# EAGLE schematic backplane_v3 (EAGLE 7.6.0)
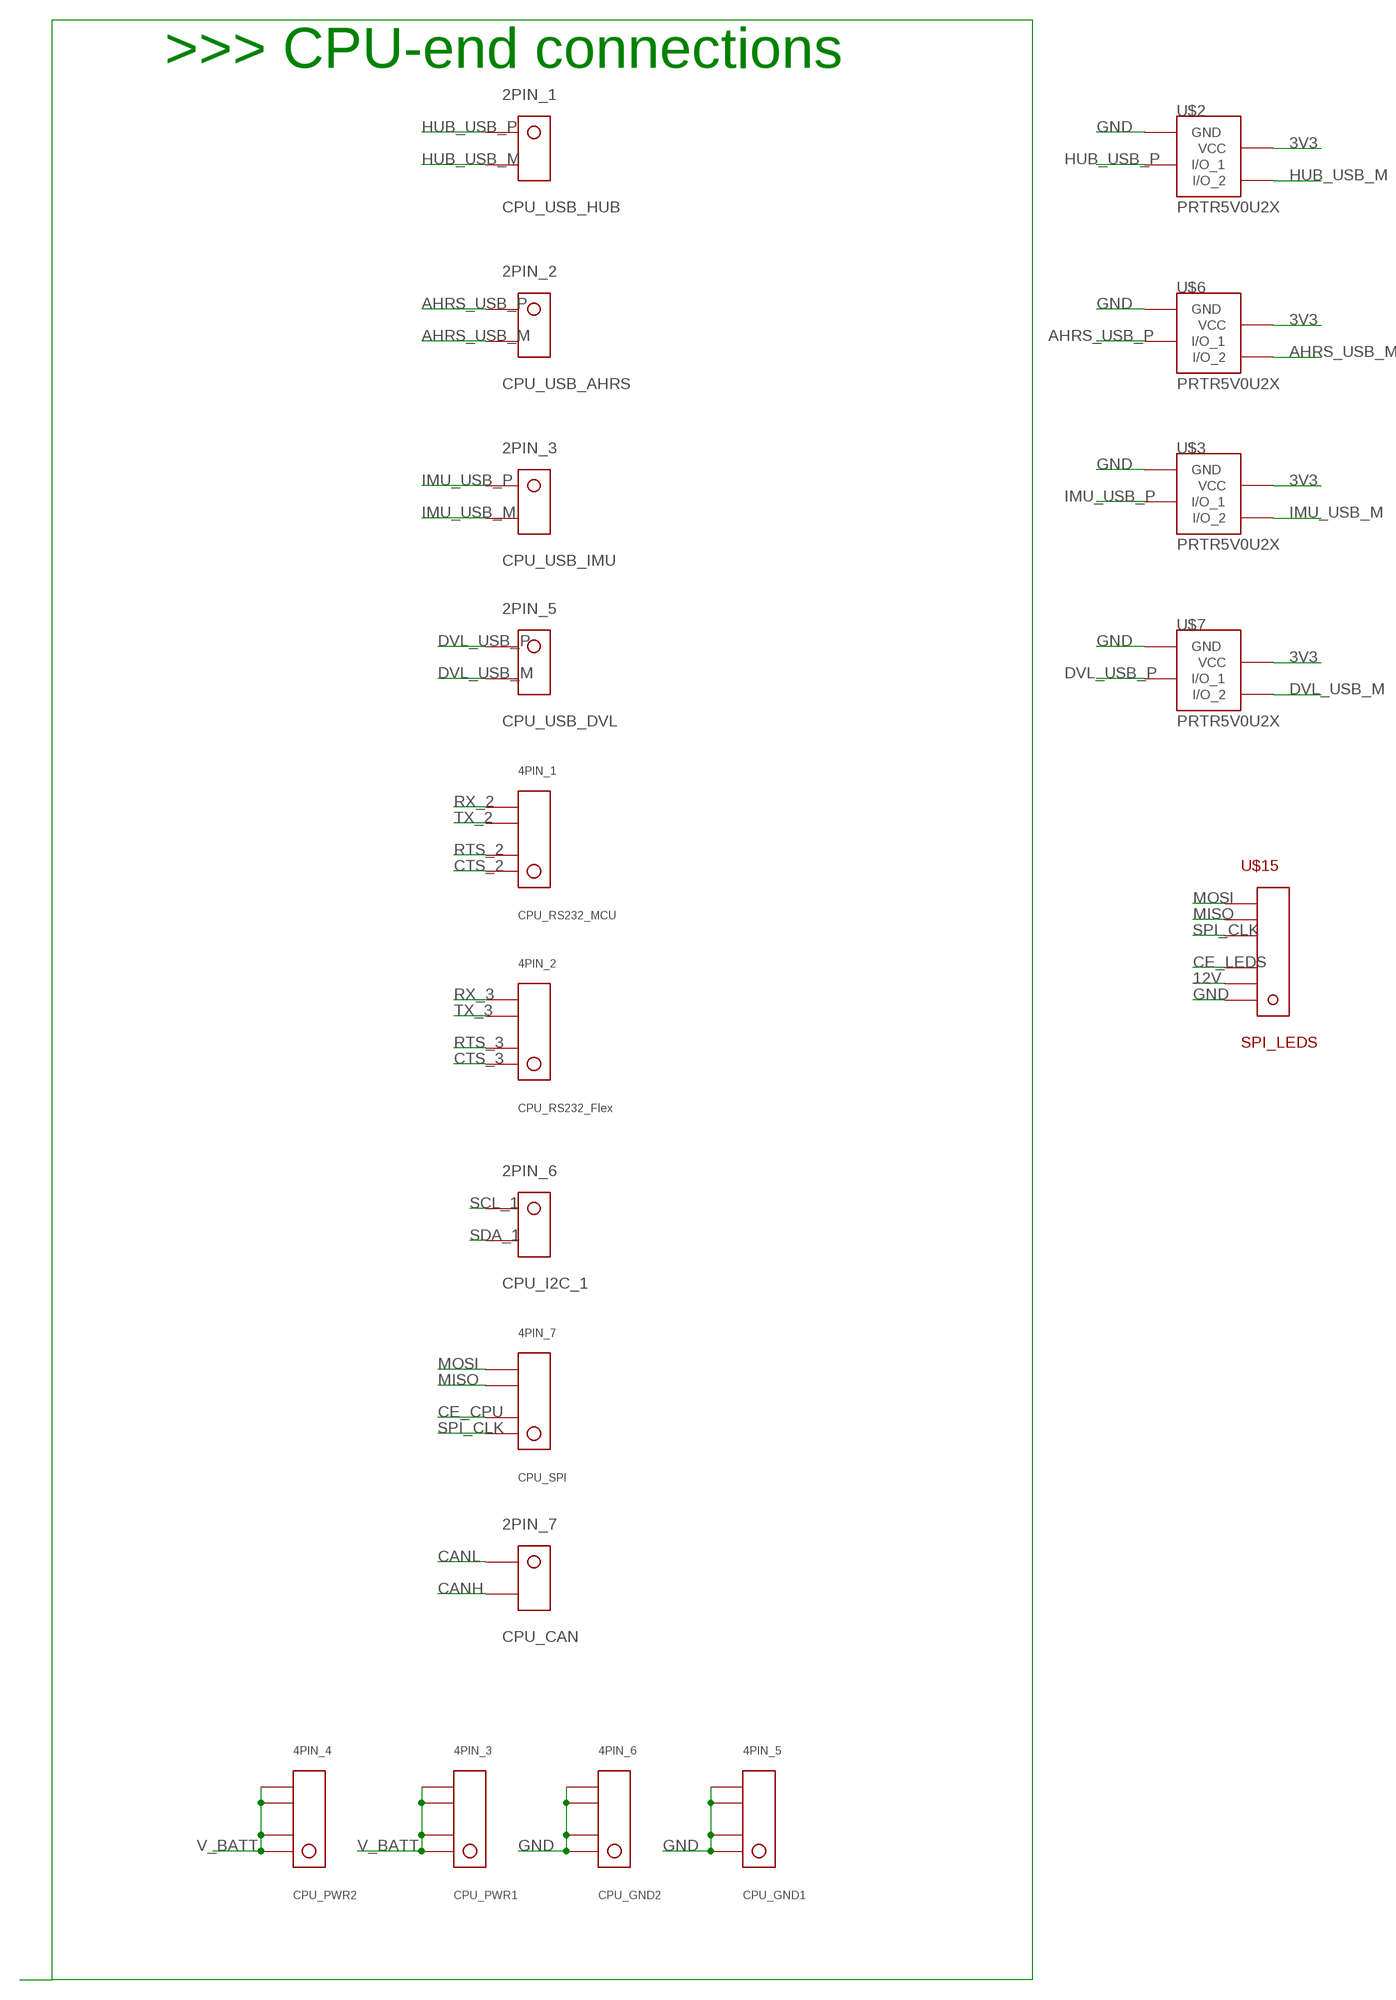
[diagram p0: schematic, sheet 1, part 1 of 3]
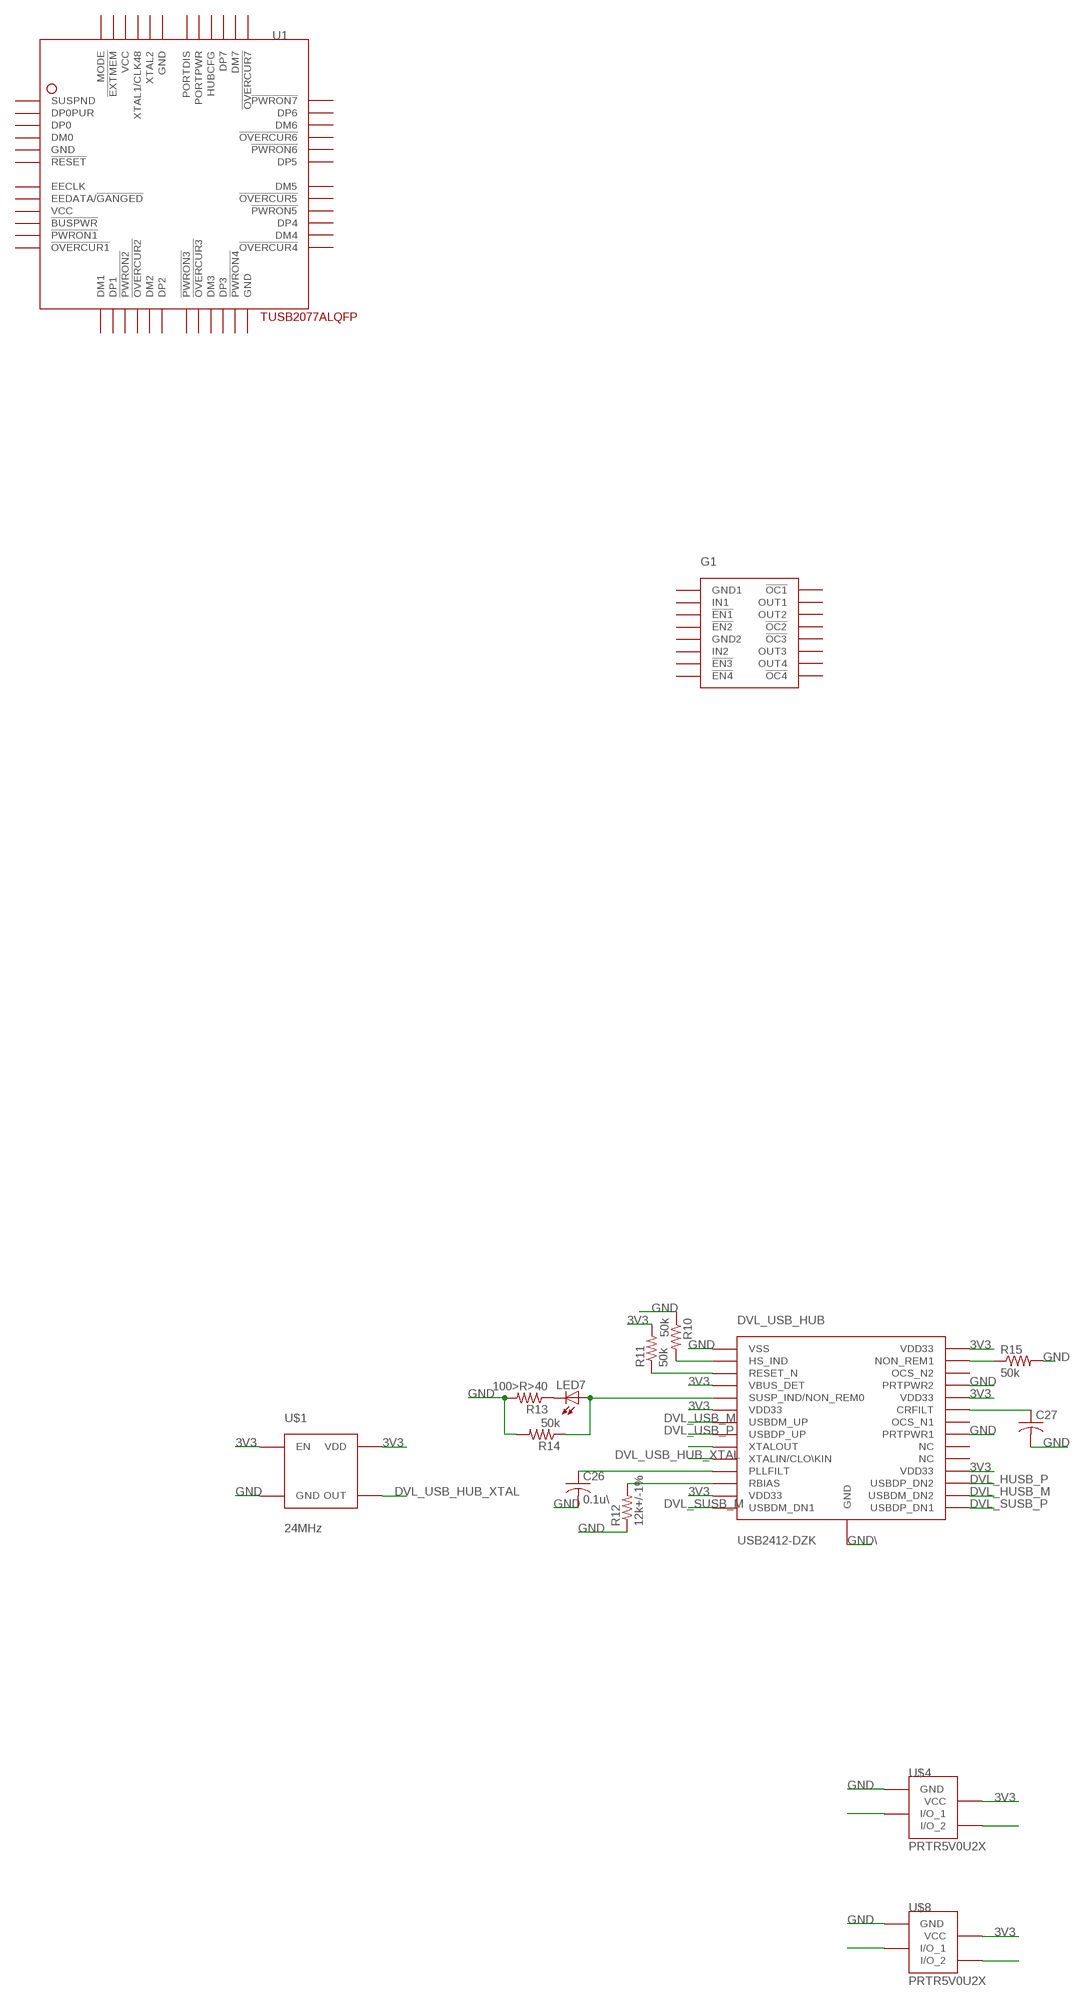
[diagram p1: schematic, sheet 1, part 2 of 3]
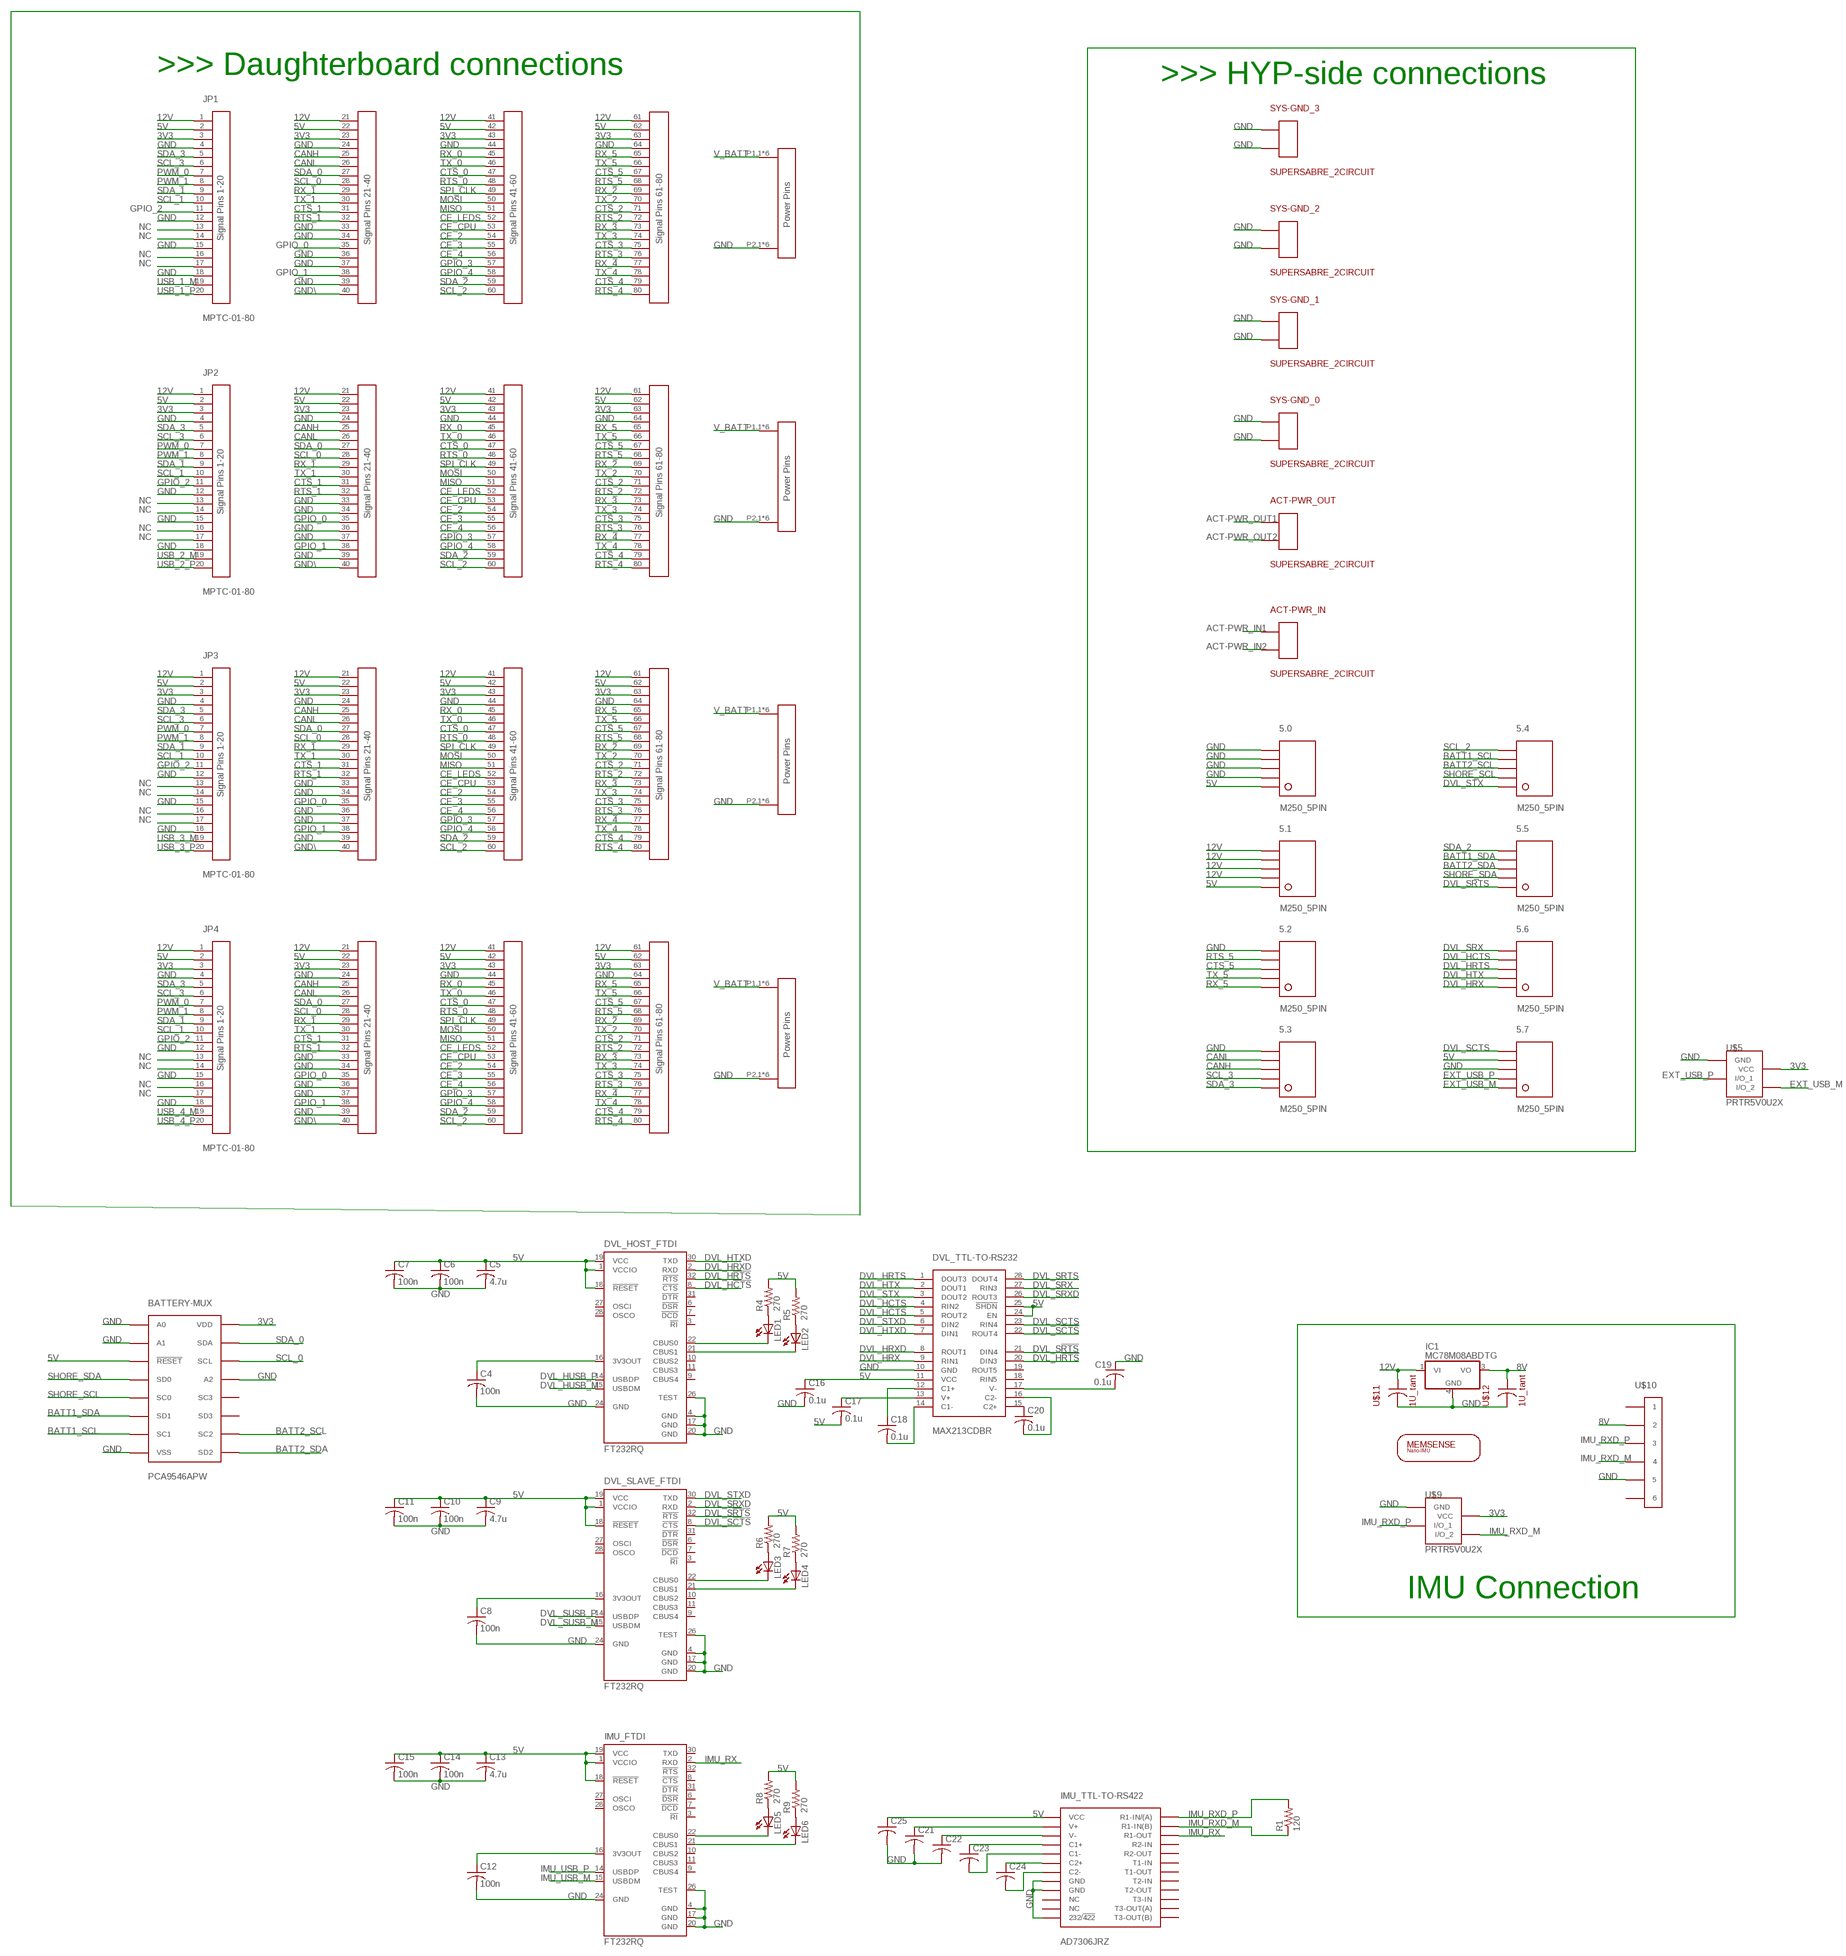
[diagram p2: schematic, sheet 1, part 3 of 3]

## Parts
2PIN_1  CPU_USB_HUB  KK254_VERT_2PIN22-29-2021  [KK254_VERT_2PIN]
2PIN_2  CPU_USB_AHRS  KK254_VERT_2PIN22-29-2021  [KK254_VERT_2PIN]
2PIN_3  CPU_USB_IMU  KK254_VERT_2PIN22-29-2021  [KK254_VERT_2PIN]
2PIN_5  CPU_USB_DVL  KK254_VERT_2PIN22-29-2021  [KK254_VERT_2PIN]
2PIN_6  CPU_I2C_1  KK254_VERT_2PIN22-29-2021  [KK254_VERT_2PIN]
2PIN_7  CPU_CAN  KK254_VERT_2PIN22-29-2021  [KK254_VERT_2PIN]
4PIN_1  CPU_RS232_MCU  KK254_VERT_4PIN22-29-2041  [KK254_VERT_4PIN]
4PIN_2  CPU_RS232_Flex  KK254_VERT_4PIN22-29-2041  [KK254_VERT_4PIN]
4PIN_3  CPU_PWR1  KK254_VERT_4PIN22-29-2041  [KK254_VERT_4PIN]
4PIN_4  CPU_PWR2  KK254_VERT_4PIN22-29-2041  [KK254_VERT_4PIN]
4PIN_5  CPU_GND1  KK254_VERT_4PIN22-29-2041  [KK254_VERT_4PIN]
4PIN_6  CPU_GND2  KK254_VERT_4PIN22-29-2041  [KK254_VERT_4PIN]
4PIN_7  CPU_SPI  KK254_VERT_4PIN22-29-2041  [KK254_VERT_4PIN]
5.0  M250_5PIN  [M205_5PIN]
5.1  M250_5PIN  [M205_5PIN]
5.2  M250_5PIN  [M205_5PIN]
5.3  M250_5PIN  [M205_5PIN]
5.4  M250_5PIN  [M205_5PIN]
5.5  M250_5PIN  [M205_5PIN]
5.6  M250_5PIN  [M205_5PIN]
5.7  M250_5PIN  [M205_5PIN]
ACT-PWR_IN  SUPERSABRE_2CIRCUIT  [SUPERSABRE_2CIRCUIT]
ACT-PWR_OUT  SUPERSABRE_2CIRCUIT  [SUPERSABRE_2CIRCUIT]
BATTERY-MUX  PCA9546APW  [TSSOP16]
C4  100n  C-USC0805  [C0805]
C5  4.7u  C-USC0805  [C0805]
C6  100n  C-USC0805  [C0805]
C7  100n  C-USC0805  [C0805]
C8  100n  C-USC0805  [C0805]
C9  4.7u  C-USC0805  [C0805]
C10  100n  C-USC0805  [C0805]
C11  100n  C-USC0805  [C0805]
C12  100n  C-USC0805  [C0805]
C13  4.7u  C-USC0805  [C0805]
C14  100n  C-USC0805  [C0805]
C15  100n  C-USC0805  [C0805]
C16  0.1u  C-USC0805  [C0805]
C17  0.1u  C-USC0805  [C0805]
C18  0.1u  C-USC0805  [C0805]
C19  0.1u  C-USC0805  [C0805]
C20  0.1u  C-USC0805  [C0805]
C21  C-USC0805  [C0805]
C22  C-USC0805  [C0805]
C23  C-USC0805  [C0805]
C24  C-USC0805  [C0805]
C25  C-USC0805  [C0805]
C26  0.1u\  C-USC0805  [C0805]
C27  C-USC0805  [C0805]
DVL_HOST_FTDI  FT232RQ  [QFN32]
DVL_SLAVE_FTDI  FT232RQ  [QFN32]
DVL_TTL-TO-RS232  MAX213CDBR  [SSOP28DB]
DVL_USB_HUB  USB2412-DZK  [QFN-28]
G1  TPS2044BBD-SOIC  [TPS2044]
IC1  MC78M08ABDTG  [DPACK_3]
IMU_FTDI  FT232RQ  [QFN32]
IMU_TTL-TO-RS422  AD7306JRZ  [SOIC-24]
JP1  MPTC-01-80  [MPTC-01-80]
JP2  MPTC-01-80  [MPTC-01-80]
JP3  MPTC-01-80  [MPTC-01-80]
JP4  MPTC-01-80  [MPTC-01-80]
LED1  LEDCHIPLED_0805  [CHIPLED_0805]
LED2  LEDCHIPLED_0805  [CHIPLED_0805]
LED3  LEDCHIPLED_0805  [CHIPLED_0805]
LED4  LEDCHIPLED_0805  [CHIPLED_0805]
LED5  LEDCHIPLED_0805  [CHIPLED_0805]
LED6  LEDCHIPLED_0805  [CHIPLED_0805]
LED7  LEDCHIPLED_0805  [CHIPLED_0805]
R1  120  R-US_R0805  [R0805]
R4  270  R-US_R0805  [R0805]
R5  270  R-US_R0805  [R0805]
R6  270  R-US_R0805  [R0805]
R7  270  R-US_R0805  [R0805]
R8  270  R-US_R0805  [R0805]
R9  270  R-US_R0805  [R0805]
R10  50k  R-US_R0805  [R0805]
R11  50k  R-US_R0805  [R0805]
R12  12k+/-1%  R-US_R0805  [R0805]
R13  100>R>40  R-US_R0805  [R0805]
R14  50k  R-US_R0805  [R0805]
R15  50k  R-US_R0805  [R0805]
SYS-GND_0  SUPERSABRE_2CIRCUIT  [SUPERSABRE_2CIRCUIT]
SYS-GND_1  SUPERSABRE_2CIRCUIT  [SUPERSABRE_2CIRCUIT]
SYS-GND_2  SUPERSABRE_2CIRCUIT  [SUPERSABRE_2CIRCUIT]
SYS-GND_3  SUPERSABRE_2CIRCUIT  [SUPERSABRE_2CIRCUIT]
U1  TUSB2077ALQFP  [48-LQFP_0.5MM_PITCH]
U$1  24MHz  DCS6XXX  [4-CDFN_3.2X2.5MM]
U$2  PRTR5V0U2X  [SOT143B]
U$3  PRTR5V0U2X  [SOT143B]
U$4  PRTR5V0U2X  [SOT143B]
U$5  PRTR5V0U2X  [SOT143B]
U$6  PRTR5V0U2X  [SOT143B]
U$7  PRTR5V0U2X  [SOT143B]
U$8  PRTR5V0U2X  [SOT143B]
U$9  PRTR5V0U2X  [SOT143B]
U$10  HR30-6R-6PD  [HR30-6R-6PD]
U$11  1U_tant  F93-XX-XXX-X-A  [F93-XX-XXX-X-A]
U$12  1U_tant  F93-XX-XXX-X-A  [F93-XX-XXX-X-A]
U$13  MEMSENSE_NIMU  [MEMSENSE_NIMU]
U$15  SPI_LEDS  KK254_6PIN  [KK254_6PIN]

## Nets
3V3: BATTERY-MUX.P$16(VDD) DVL_USB_HUB.P$4(VDD33) DVL_USB_HUB.P$10(VDD33) DVL_USB_HUB.P$14(VDD33) DVL_USB_HUB.P$18(VBUS_DET) DVL_USB_HUB.P$20(VDD33) DVL_USB_HUB.P$27(VDD33) JP1.3 JP1.23 JP1.43 JP1.63 JP2.3 JP2.23 JP2.43 JP2.63 JP3.3 JP3.23 JP3.43 JP3.63 JP4.3 JP4.23 JP4.43 JP4.63 R11.2 U$1.P$1(EN) U$1.P$4(VDD) U$2.P$4(VCC) U$3.P$4(VCC) U$4.P$4(VCC) U$5.P$4(VCC) U$6.P$4(VCC) U$7.P$4(VCC) U$8.P$4(VCC) U$9.P$4(VCC)
5V: 5.0.P$1 5.0.P$2 5.1.P$1 5.1.P$2 5.7.P$7 5.7.P$8 BATTERY-MUX.P$3(!RESET!) C5.1 C6.1 C7.1 C9.1 C10.1 C11.1 C13.1 C14.1 C15.1 C16.1 C17.2 C25.1 DVL_HOST_FTDI.1(VCCIO) DVL_HOST_FTDI.18(!RESET) DVL_HOST_FTDI.19(VCC) DVL_SLAVE_FTDI.1(VCCIO) DVL_SLAVE_FTDI.18(!RESET) DVL_SLAVE_FTDI.19(VCC) DVL_TTL-TO-RS232.11(VCC) DVL_TTL-TO-RS232.24(EN) DVL_TTL-TO-RS232.25(!SHDN!) IMU_FTDI.1(VCCIO) IMU_FTDI.18(!RESET) IMU_FTDI.19(VCC) IMU_TTL-TO-RS422.P$7(VCC) JP1.2 JP1.22 JP1.42 JP1.62 JP2.2 JP2.22 JP2.42 JP2.62 JP3.2 JP3.22 JP3.42 JP3.62 JP4.2 JP4.22 JP4.42 JP4.62 R4.2 R5.2 R6.2 R7.2 R8.2 R9.2
8V: IC1.3(VO) U$10.P$2 U$12.P$1(+)
12V: 5.1.P$3 5.1.P$4 5.1.P$5 5.1.P$6 5.1.P$7 5.1.P$8 5.1.P$9 5.1.P$10 IC1.1(VI) JP1.1 JP1.21 JP1.41 JP1.61 JP2.1 JP2.21 JP2.41 JP2.61 JP3.1 JP3.21 JP3.41 JP3.61 JP4.1 JP4.21 JP4.41 JP4.61 U$11.P$1(+) U$15.P$2
ACT-PWR_IN1: ACT-PWR_IN.P$1
ACT-PWR_IN2: ACT-PWR_IN.P$2
ACT-PWR_OUT1: ACT-PWR_OUT.P$1
ACT-PWR_OUT2: ACT-PWR_OUT.P$2
AHRS_USB_M: 2PIN_2.P$2 U$6.P$3(I/O_2)
AHRS_USB_P: 2PIN_2.P$1 U$6.P$2(I/O_1)
BATT1_SCL: 5.4.P$7 5.4.P$8 BATTERY-MUX.P$7(SC1)
BATT1_SDA: 5.5.P$7 5.5.P$8 BATTERY-MUX.P$6(SD1)
BATT2_SCL: 5.4.P$5 5.4.P$6 BATTERY-MUX.P$10(SC2)
BATT2_SDA: 5.5.P$5 5.5.P$6 BATTERY-MUX.P$9(SD2)
CANH: 2PIN_7.P$2 5.3.P$5 5.3.P$6 JP1.25 JP2.25 JP3.25 JP4.25
CANL: 2PIN_7.P$1 5.3.P$7 5.3.P$8 JP1.26 JP2.26 JP3.26 JP4.26
CE_2: JP1.54 JP2.54 JP3.54 JP4.54
CE_3: JP1.55 JP2.55 JP3.55 JP4.55
CE_4: JP1.56 JP2.56 JP3.56 JP4.56
CE_CPU: 4PIN_7.P$2 JP1.53 JP2.53 JP3.53 JP4.53
CE_LEDS: JP1.52 JP2.52 JP3.52 JP4.52 U$15.P$3
CTS_0: JP1.47 JP2.47 JP3.47 JP4.47
CTS_1: JP1.31 JP2.31 JP3.31 JP4.31
CTS_2: 4PIN_1.P$1 JP1.71 JP2.71 JP3.71 JP4.71
CTS_3: 4PIN_2.P$1 JP1.75 JP2.75 JP3.75 JP4.75
CTS_4: JP1.79 JP2.79 JP3.79 JP4.79
CTS_5: 5.2.P$5 5.2.P$6 JP1.67 JP2.67 JP3.67 JP4.67
DVL_H!CTS!: DVL_HOST_FTDI.8(!CTS) DVL_TTL-TO-RS232.5(ROUT2)
DVL_H!RTS!: DVL_HOST_FTDI.32(!RTS) DVL_TTL-TO-RS232.20(DIN3)
DVL_HCTS: 5.6.P$7 5.6.P$8 DVL_TTL-TO-RS232.4(RIN2)
DVL_HRTS: 5.6.P$5 5.6.P$6 DVL_TTL-TO-RS232.1(DOUT3)
DVL_HRX: 5.6.P$1 5.6.P$2 DVL_TTL-TO-RS232.9(RIN1)
DVL_HRXD: DVL_HOST_FTDI.2(RXD) DVL_TTL-TO-RS232.8(ROUT1)
DVL_HTX: 5.6.P$3 5.6.P$4 DVL_TTL-TO-RS232.2(DOUT1)
DVL_HTXD: DVL_HOST_FTDI.30(TXD) DVL_TTL-TO-RS232.7(DIN1)
DVL_HUSB_M: DVL_HOST_FTDI.15(USBDM) DVL_USB_HUB.P$2(USBDM_DN2)
DVL_HUSB_P: DVL_HOST_FTDI.14(USBDP) DVL_USB_HUB.P$3(USBDP_DN2)
DVL_S!CTS!: DVL_SLAVE_FTDI.8(!CTS) DVL_TTL-TO-RS232.22(ROUT4)
DVL_S!RTS!: DVL_SLAVE_FTDI.32(!RTS) DVL_TTL-TO-RS232.21(DIN4)
DVL_SCTS: 5.7.P$9 5.7.P$10 DVL_TTL-TO-RS232.23(RIN4)
DVL_SRTS: 5.5.P$1 5.5.P$2 DVL_TTL-TO-RS232.28(DOUT4)
DVL_SRX: 5.6.P$9 5.6.P$10 DVL_TTL-TO-RS232.27(RIN3)
DVL_SRXD: DVL_SLAVE_FTDI.2(RXD) DVL_TTL-TO-RS232.26(ROUT3)
DVL_STX: 5.4.P$1 5.4.P$2 DVL_TTL-TO-RS232.3(DOUT2)
DVL_STXD: DVL_SLAVE_FTDI.30(TXD) DVL_TTL-TO-RS232.6(DIN2)
DVL_SUSB_M: DVL_SLAVE_FTDI.15(USBDM) DVL_USB_HUB.P$28(USBDM_DN1)
DVL_SUSB_P: DVL_SLAVE_FTDI.14(USBDP) DVL_USB_HUB.P$1(USBDP_DN1)
DVL_USB_HUB_XTAL: DVL_USB_HUB.P$24(XTALIN/CLO\KIN) U$1.P$3(OUT)
DVL_USB_M: 2PIN_5.P$2 DVL_USB_HUB.P$21(USBDM_UP) U$7.P$3(I/O_2)
DVL_USB_P: 2PIN_5.P$1 DVL_USB_HUB.P$22(USBDP_UP) U$7.P$2(I/O_1)
EXT_USB_M: 5.7.P$1 5.7.P$2 U$5.P$3(I/O_2)
EXT_USB_P: 5.7.P$3 5.7.P$4 U$5.P$2(I/O_1)
GND: 4PIN_5.P$1 4PIN_5.P$2 4PIN_5.P$3 4PIN_5.P$4 4PIN_6.P$1 4PIN_6.P$2 4PIN_6.P$3 4PIN_6.P$4 5.0.P$3 5.0.P$4 5.0.P$5 5.0.P$6 5.0.P$7 5.0.P$8 5.0.P$9 5.0.P$10 5.2.P$9 5.2.P$10 5.3.P$9 5.3.P$10 5.7.P$5 5.7.P$6 BATTERY-MUX.P$1(A0) BATTERY-MUX.P$2(A1) BATTERY-MUX.P$8(VSS) BATTERY-MUX.P$13(A2) C4.2 C5.2 C6.2 C7.2 C8.2 C9.2 C10.2 C11.2 C12.2 C13.2 C14.2 C15.2 C16.2 C19.1 C21.2 C22.2 C25.2 C26.2 C27.2 DVL_HOST_FTDI.4(GND) DVL_HOST_FTDI.17(GND) DVL_HOST_FTDI.20(GND) DVL_HOST_FTDI.24(GND) DVL_HOST_FTDI.26(TEST) DVL_SLAVE_FTDI.4(GND) DVL_SLAVE_FTDI.17(GND) DVL_SLAVE_FTDI.20(GND) DVL_SLAVE_FTDI.24(GND) DVL_SLAVE_FTDI.26(TEST) DVL_TTL-TO-RS232.10(GND) DVL_USB_HUB.P$7(PRTPWR1) DVL_USB_HUB.P$11(PRTPWR2) DVL_USB_HUB.P$15(VSS) IC1.4(GND) IMU_FTDI.4(GND) IMU_FTDI.17(GND) IMU_FTDI.20(GND) IMU_FTDI.24(GND) IMU_FTDI.26(TEST) IMU_TTL-TO-RS422.P$14(GND) IMU_TTL-TO-RS422.P$15(232/!422!) IMU_TTL-TO-RS422.P$18(GND) JP1.4 JP1.12 JP1.15 JP1.18 JP1.24 JP1.33 JP1.34 JP1.36 JP1.37 JP1.39 JP1.44 JP1.64 JP1.P2,1(POWER2) JP1.P2,2(POWER2) JP1.P2,3(POWER2) JP1.P2,4(POWER2) JP1.P2,5(POWER2) JP1.P2,6(POWER2) JP2.4 JP2.12 JP2.15 JP2.18 JP2.24 JP2.33 JP2.34 JP2.36 JP2.37 JP2.39 JP2.44 JP2.64 JP2.P2,1(POWER2) JP2.P2,2(POWER2) JP2.P2,3(POWER2) JP2.P2,4(POWER2) JP2.P2,5(POWER2) JP2.P2,6(POWER2) JP3.4 JP3.12 JP3.15 JP3.18 JP3.24 JP3.33 JP3.34 JP3.36 JP3.37 JP3.39 JP3.44 JP3.64 JP3.P2,1(POWER2) JP3.P2,2(POWER2) JP3.P2,3(POWER2) JP3.P2,4(POWER2) JP3.P2,5(POWER2) JP3.P2,6(POWER2) JP4.4 JP4.12 JP4.15 JP4.18 JP4.24 JP4.33 JP4.34 JP4.36 JP4.37 JP4.39 JP4.44 JP4.64 JP4.P2,1(POWER2) JP4.P2,2(POWER2) JP4.P2,3(POWER2) JP4.P2,4(POWER2) JP4.P2,5(POWER2) JP4.P2,6(POWER2) R10.1 R12.1 R13.2 R14.2 R15.2 SYS-GND_0.P$1 SYS-GND_0.P$2 SYS-GND_1.P$1 SYS-GND_1.P$2 SYS-GND_2.P$1 SYS-GND_2.P$2 SYS-GND_3.P$1 SYS-GND_3.P$2 U$1.P$2(GND) U$2.P$1(GND) U$3.P$1(GND) U$4.P$1(GND) U$5.P$1(GND) U$6.P$1(GND) U$7.P$1(GND) U$8.P$1(GND) U$9.P$1(GND) U$10.P$5 U$11.P$2(-) U$12.P$2(-) U$15.P$1
GND\: DVL_USB_HUB.P$29(GND) JP1.40 JP2.40 JP3.40 JP4.40
GPIO_0: JP1.35 JP2.35 JP3.35 JP4.35
GPIO_1: JP1.38 JP2.38 JP3.38 JP4.38
GPIO_2: JP1.11 JP2.11 JP3.11 JP4.11
GPIO_3: JP1.57 JP2.57 JP3.57 JP4.57
GPIO_4: JP1.58 JP2.58 JP3.58 JP4.58
HUB_USB_M: 2PIN_1.P$2 U$2.P$3(I/O_2)
HUB_USB_P: 2PIN_1.P$1 U$2.P$2(I/O_1)
IMU_RX: IMU_FTDI.2(RXD) IMU_TTL-TO-RS422.P$17(R1-OUT)
IMU_RXD_M: IMU_TTL-TO-RS422.P$8(R1-IN(B)) R1.1 U$9.P$3(I/O_2) U$10.P$4
IMU_RXD_P: IMU_TTL-TO-RS422.P$9(R1-IN/(A)) R1.2 U$9.P$2(I/O_1) U$10.P$3
IMU_USB_M: 2PIN_3.P$2 IMU_FTDI.15(USBDM) U$3.P$3(I/O_2)
IMU_USB_P: 2PIN_3.P$1 IMU_FTDI.14(USBDP) U$3.P$2(I/O_1)
MISO: 4PIN_7.P$3 JP1.51 JP2.51 JP3.51 JP4.51 U$15.P$5
MOSI: 4PIN_7.P$4 JP1.50 JP2.50 JP3.50 JP4.50 U$15.P$6
N$3: C8.1 DVL_SLAVE_FTDI.16(3V3OUT)
N$4: DVL_SLAVE_FTDI.21(CBUS1) LED4.C
N$8: U$4.P$2(I/O_1)
N$9: U$4.P$3(I/O_2)
N$16: U$8.P$2(I/O_1)
N$17: U$8.P$3(I/O_2)
N$22: DVL_SLAVE_FTDI.22(CBUS0) LED3.C
N$23: LED3.A R6.1
N$24: LED4.A R7.1
N$25: C4.1 DVL_HOST_FTDI.16(3V3OUT)
N$26: C12.1 IMU_FTDI.16(3V3OUT)
N$27: IMU_FTDI.21(CBUS1) LED6.C
N$28: IMU_FTDI.22(CBUS0) LED5.C
N$29: LED5.A R8.1
N$30: LED6.A R9.1
N$31: C18.1 DVL_TTL-TO-RS232.12(C1+)
N$32: C18.2 DVL_TTL-TO-RS232.14(C1-)
N$33: DVL_HOST_FTDI.21(CBUS1) LED2.C
N$34: DVL_HOST_FTDI.22(CBUS0) LED1.C
N$35: C20.2 DVL_TTL-TO-RS232.16(C2-)
N$36: LED7.C R13.1
N$37: C21.1 IMU_TTL-TO-RS422.P$1(V+)
N$38: C22.1 IMU_TTL-TO-RS422.P$24(V-)
N$39: C23.1 IMU_TTL-TO-RS422.P$2(C1+)
N$40: C23.2 IMU_TTL-TO-RS422.P$3(C1-)
N$41: C24.1 IMU_TTL-TO-RS422.P$22(C2+)
N$42: C24.2 IMU_TTL-TO-RS422.P$23(C2-)
N$43: LED1.A R4.1
N$44: LED2.A R5.1
N$45: DVL_USB_HUB.P$16(HS_IND) R10.2
N$46: DVL_USB_HUB.P$17(RESET_N) R11.1
N$49: DVL_USB_HUB.P$19(SUSP_IND/NON_REM0) LED7.A R14.1
N$52: DVL_USB_HUB.P$23(XTALOUT)
N$54: C26.1 DVL_USB_HUB.P$25(PLLFILT)
N$55: C17.1 DVL_TTL-TO-RS232.13(V+)
N$56: DVL_USB_HUB.P$26(RBIAS) R12.2
N$57: C20.1 DVL_TTL-TO-RS232.15(C2+)
N$59: C19.2 DVL_TTL-TO-RS232.17(V-)
N$67: C27.1 DVL_USB_HUB.P$9(CRFILT)
N$71: DVL_USB_HUB.P$13(NON_REM1) R15.1
NC: JP1.13 JP1.14 JP1.16 JP1.17 JP2.13 JP2.14 JP2.16 JP2.17 JP3.13 JP3.14 JP3.16 JP3.17 JP4.13 JP4.14 JP4.16 JP4.17
PWM_0: JP1.7 JP2.7 JP3.7 JP4.7
PWM_1: JP1.8 JP2.8 JP3.8 JP4.8
RTS_0: JP1.48 JP2.48 JP3.48 JP4.48
RTS_1: JP1.32 JP2.32 JP3.32 JP4.32
RTS_2: 4PIN_1.P$2 JP1.72 JP2.72 JP3.72 JP4.72
RTS_3: 4PIN_2.P$2 JP1.76 JP2.76 JP3.76 JP4.76
RTS_4: JP1.80 JP2.80 JP3.80 JP4.80
RTS_5: 5.2.P$7 5.2.P$8 JP1.68 JP2.68 JP3.68 JP4.68
RX_0: JP1.45 JP2.45 JP3.45 JP4.45
RX_1: JP1.29 JP2.29 JP3.29 JP4.29
RX_2: 4PIN_1.P$4 JP1.69 JP2.69 JP3.69 JP4.69
RX_3: 4PIN_2.P$4 JP1.73 JP2.73 JP3.73 JP4.73
RX_4: JP1.77 JP2.77 JP3.77 JP4.77
RX_5: 5.2.P$1 5.2.P$2 JP1.65 JP2.65 JP3.65 JP4.65
SCL_0: BATTERY-MUX.P$14(SCL) JP1.28 JP2.28 JP3.28 JP4.28
SCL_1: 2PIN_6.P$1 JP1.10 JP2.10 JP3.10 JP4.10
SCL_2: 5.4.P$9 5.4.P$10 JP1.60 JP2.60 JP3.60 JP4.60
SCL_3: 5.3.P$3 5.3.P$4 JP1.6 JP2.6 JP3.6 JP4.6
SDA_0: BATTERY-MUX.P$15(SDA) JP1.27 JP2.27 JP3.27 JP4.27
SDA_1: 2PIN_6.P$2 JP1.9 JP2.9 JP3.9 JP4.9
SDA_2: 5.5.P$9 5.5.P$10 JP1.59 JP2.59 JP3.59 JP4.59
SDA_3: 5.3.P$1 5.3.P$2 JP1.5 JP2.5 JP3.5 JP4.5
SHORE_SCL: 5.4.P$3 5.4.P$4 BATTERY-MUX.P$5(SC0)
SHORE_SDA: 5.5.P$3 5.5.P$4 BATTERY-MUX.P$4(SD0)
SPI_CLK: 4PIN_7.P$1 JP1.49 JP2.49 JP3.49 JP4.49 U$15.P$4
TX_0: JP1.46 JP2.46 JP3.46 JP4.46
TX_1: JP1.30 JP2.30 JP3.30 JP4.30
TX_2: 4PIN_1.P$3 JP1.70 JP2.70 JP3.70 JP4.70
TX_3: 4PIN_2.P$3 JP1.74 JP2.74 JP3.74 JP4.74
TX_4: JP1.78 JP2.78 JP3.78 JP4.78
TX_5: 5.2.P$3 5.2.P$4 JP1.66 JP2.66 JP3.66 JP4.66
USB_1_M: JP1.19
USB_1_P: JP1.20
USB_2_M: JP2.19
USB_2_P: JP2.20
USB_3_M: JP3.19
USB_3_P: JP3.20
USB_4_M: JP4.19
USB_4_P: JP4.20
V_BATT: 4PIN_3.P$1 4PIN_3.P$2 4PIN_3.P$3 4PIN_3.P$4 4PIN_4.P$1 4PIN_4.P$2 4PIN_4.P$3 4PIN_4.P$4 JP1.P1,1(POWER1) JP1.P1,2(POWER1) JP1.P1,3(POWER1) JP1.P1,4(POWER1) JP1.P1,5(POWER1) JP1.P1,6(POWER1) JP2.P1,1(POWER1) JP2.P1,2(POWER1) JP2.P1,3(POWER1) JP2.P1,4(POWER1) JP2.P1,5(POWER1) JP2.P1,6(POWER1) JP3.P1,1(POWER1) JP3.P1,2(POWER1) JP3.P1,3(POWER1) JP3.P1,4(POWER1) JP3.P1,5(POWER1) JP3.P1,6(POWER1) JP4.P1,1(POWER1) JP4.P1,2(POWER1) JP4.P1,3(POWER1) JP4.P1,4(POWER1) JP4.P1,5(POWER1) JP4.P1,6(POWER1)
Unconnected: BATTERY-MUX.P$11(SD3) BATTERY-MUX.P$12(SC3) DVL_HOST_FTDI.3(!RI) DVL_HOST_FTDI.6(!DSR) DVL_HOST_FTDI.7(!DCD) DVL_HOST_FTDI.9(CBUS4) DVL_HOST_FTDI.10(CBUS2) DVL_HOST_FTDI.11(CBUS3) DVL_HOST_FTDI.27(OSCI) DVL_HOST_FTDI.28(OSCO) DVL_HOST_FTDI.31(!DTR) DVL_SLAVE_FTDI.3(!RI) DVL_SLAVE_FTDI.6(!DSR) DVL_SLAVE_FTDI.7(!DCD) DVL_SLAVE_FTDI.9(CBUS4) DVL_SLAVE_FTDI.10(CBUS2) DVL_SLAVE_FTDI.11(CBUS3) DVL_SLAVE_FTDI.27(OSCI) DVL_SLAVE_FTDI.28(OSCO) DVL_SLAVE_FTDI.31(!DTR) DVL_TTL-TO-RS232.18(RIN5) DVL_TTL-TO-RS232.19(ROUT5) DVL_USB_HUB.P$5(NC) DVL_USB_HUB.P$6(NC) DVL_USB_HUB.P$8(OCS_N1) DVL_USB_HUB.P$12(OCS_N2) G1.!EN1! G1.!EN2! G1.!EN3! G1.!EN4! G1.!OC1! G1.!OC2! G1.!OC3! G1.!OC4! G1.GND1 G1.GND2 G1.IN1 G1.IN2 G1.OUT1 G1.OUT2 G1.OUT3 G1.OUT4 IMU_FTDI.3(!RI) IMU_FTDI.6(!DSR) IMU_FTDI.7(!DCD) IMU_FTDI.8(!CTS) IMU_FTDI.9(CBUS4) IMU_FTDI.10(CBUS2) IMU_FTDI.11(CBUS3) IMU_FTDI.27(OSCI) IMU_FTDI.28(OSCO) IMU_FTDI.30(TXD) IMU_FTDI.31(!DTR) IMU_FTDI.32(!RTS) IMU_TTL-TO-RS422.P$4(R2-IN) IMU_TTL-TO-RS422.P$5(T1-OUT) IMU_TTL-TO-RS422.P$6(T2-OUT) IMU_TTL-TO-RS422.P$10(T3-OUT(B)) IMU_TTL-TO-RS422.P$11(T3-OUT(A)) IMU_TTL-TO-RS422.P$12(NC) IMU_TTL-TO-RS422.P$13(NC) IMU_TTL-TO-RS422.P$16(T3-IN) IMU_TTL-TO-RS422.P$19(T2-IN) IMU_TTL-TO-RS422.P$20(T1-IN) IMU_TTL-TO-RS422.P$21(R2-OUT) U1.P$1(SUSPND) U1.P$2(DP0PUR) U1.P$3(DP0) U1.P$4(DM0) U1.P$5(GND) U1.P$6(!RESET!) U1.P$7(EECLK) U1.P$8(EEDATA/!GANGED!) U1.P$9(VCC) U1.P$10(!BUSPWR!) U1.P$11(!PWRON1!) U1.P$12(!OVERCUR1!) U1.P$13(DM1) U1.P$14(DP1) U1.P$15(!PWRON2!) U1.P$16(!OVERCUR2!) U1.P$17(DM2) U1.P$18(DP2) U1.P$19(!PWRON3!) U1.P$20(!OVERCUR3!) U1.P$21(DM3) U1.P$22(DP3) U1.P$23(!PWRON4!) U1.P$24(GND) U1.P$25(!OVERCUR4!) U1.P$26(DM4) U1.P$27(DP4) U1.P$28(!PWRON5!) U1.P$29(!OVERCUR5!) U1.P$30(DM5) U1.P$31(DP5) U1.P$32(!PWRON6!) U1.P$33(!OVERCUR6!) U1.P$34(DM6) U1.P$35(DP6) U1.P$36(!PWRON7!) U1.P$37(!OVERCUR7!) U1.P$38(DM7) U1.P$39(DP7) U1.P$40(HUBCFG) U1.P$41(PORTPWR) U1.P$42(PORTDIS) U1.P$43(GND) U1.P$44(XTAL2) U1.P$45(XTAL1/CLK48) U1.P$46(VCC) U1.P$47(!EXTMEM!) U1.P$48(MODE) U$10.P$1 U$10.P$6

## Notes on the sheet
- >>> Daughterboard connections | >>> HYP-side connections
- >>> CPU-end connections
- IMU Connection

## Library data of the parts
2PIN_1-2PIN_3 2PIN_5-2PIN_7 = molex:KK254_VERT_2PIN: KK® 254 Wire-to-Board Header, Vertical, with Friction Lock, 2 Circuits, Gold (Au) Plating Part Number: 22-29-2021 http://www.molex.com/molex/products/datasheet.jsp?part=active/0022292021_PCB_HEADERS.xml
4PIN_1-4PIN_7 = molex:KK254_VERT_4PIN: KK® 254 Wire-to-Board Header, Vertical, with Friction Lock, 4 Circuits, Gold (Au) Plating Part Number: 22-29-2041 http://www.molex.com/molex/products/datasheet.jsp?part=active/0022292041_PCB_HEADERS.xml
5.0 5.1-5.7 = molex:M250_5PIN: 5-pin Eurostyle Terminal Block Title: 2.54mm Pitch, Eurostyle™ Fixed-Mount Push-Button Terminal Block, Vertical, 6A, 26-18 AWG, Green, 5 Circuits Part number: 397000205
ACT-PWR_IN ACT-PWR_OUT SYS-GND_0 SYS-GND_1-SYS-GND_3 = molex:SUPERSABRE_2CIRCUIT
BATTERY-MUX = NXP:PCA9546APW: NXP 1:4 I2C Multiplexer TSSOP16 package Part number: PCA9546APW
C4-C27 = resistor:C-US: CAPACITOR, American symbol
DVL_HOST_FTDI DVL_SLAVE_FTDI IMU_FTDI = ftdichip:FT232R: Source: http://www.ftdichip.com/Documents/DataSheets/DS_FT232R_v104.pdf; MPN: FT232RQ; OC_FARNELL: 1146033; OC_NEWARK: 91K9919
DVL_TTL-TO-RS232 = texas:MAX213CDBR: Texas Instruments MAX213CDBR 5-V MULTICHANNEL RS-232 LINE DRIVER/RECEIVER WITH ±15-kV ESD PROTECTION SSOP28DB package
DVL_USB_HUB = smsc:USB2412-DZK: SMSC USB2412 2-port USB 2.0 Hub Controller 28-pin QFN package Made by Microchip
G1 = texas:TPS2044B: Texas Instruments TPS2044BD-SOIC Current-limited power distribution switches 0.5A continuous current, 1.25A max current, 3.3-5V Datasheet <http://www.ti.com/lit/ds/symlink/tps2044b.pdf> NOTE: These replace the older TPS2044/54 switches.
IC1 = linear:MC78M: 500 mA Positive Voltage Regulators Source: Data sheet <http://www.onsemi.com/pub_link/Collateral/MC78M00-D.PDF>
IMU_TTL-TO-RS422 = analog_devices:AD7306JRZ: AD7306 - 24 SOIC package RS232/RS422 Transciever
JP1-JP4 = samtec:MPTC-01-80: Samtec 30A Signal/Power Combo System Part number: MPTC-01-80-01 Datasheet <http://suddendocs.samtec.com/catalog_english/mptc.pdf>, Drawing <http://suddendocs.samtec.com/prints/mptc-xx-xx-xx-6.30-xx-x-v-xx-mkt.pdf>, Footprint <http://suddendocs.samtec.com/prints/mptc-xx-xx-xx-6.30-xx-x-v-xx-footprint.pdf> Created by: Ben Hurwitz Created on: 3 Dec 2015 Project: Backplane Group: Robotics @ Maryland Autonomous Submarine University of Maryland, College Park, MD, USA Description; This is an 82-pin female signal/power combination plug, with 80 5A signal pins and 2 24.7A power blades (each uses six pins). It was designed to be used on a backplane for the autonomous submarine to connect the four main daughterboards to the CPU and batteries via the backplane. It fits with the Samtec MPSC male half.
LED1-LED7 = led:LED: LED OSRAM: - CHIPLED LG R971, LG N971, LY N971, LG Q971, LY Q971, LO R971, LY R971 LH N974, LH R974 LS Q976, LO Q976, LY Q976 LO Q996 - Hyper CHIPLED LW Q18S LB Q993, LB Q99A, LB R99A - SideLED LS A670, LO A670, LY A670, LG A670, LP A670 LB A673, LV A673, LT A673, LW A673 LH A674 LY A675 LS A676, LA A676, LO A676, LY A676, LW A676 LS A679, LY A679, LG A679 - Hyper Micro SIDELED® LS Y876, LA Y876, LO Y876, LY Y876 LT Y87S - SmartLED LW L88C, LW L88S LB L89C, LB L89S, LG L890 LS L89K, LO L89K, LY L89K LS L896, LA L896, LO L896, LY L896 - TOPLED LS T670, LO T670, LY T670, LG T670, LP T670 LSG T670, LSP T670, LSY T670, LOP T670, LYG T670 LG T671, LOG T671, LSG T671 LB T673, LV T673, LT T673, LW T673 LH T674 LS T676, LA T676, LO T676, LY T676, LB T676, LH T676, LSB T676, LW T676 LB T67C, LV T67C, LT T67C, LS T67K, LO T67K, LY T67K, LW E67C LS E67B, LA E67B, LO E67B, LY E67B, LB E67C, LV E67C, LT E67C LW T67C LS T679, LY T679, LG T679 LS T770, LO T770, LY T770, LG T770, LP T770 LB T773, LV T773, LT T773, LW T773 LH T774 LS E675, LA E675, LY E675, LS T675 LS T776, LA T776, LO T776, LY T776, LB T776 LHGB T686 LT T68C, LB T68C - Hyper Mini TOPLED® LB M676 - Mini TOPLED Santana® LG M470 LS M47K, LO M47K, LY M47K Source: http://www.osram.convergy.de LUXEON: - LUMILED® LXK2-PW12-R00, LXK2-PW12-S00, LXK2-PW14-U00, LXK2-PW14-V00 LXK2-PM12-R00, LXK2-PM12-S00, LXK2-PM14-U00 LXK2-PE12-Q00, LXK2-PE12-R00, LXK2-PE12-S00, LXK2-PE14-T00, LXK2-PE14-U00 LXK2-PB12-K00, LXK2-PB12-L00, LXK2-PB12-M00, LXK2-PB14-N00, LXK2-PB14-P00, LXK2-PB14-Q00 LXK2-PR12-L00, LXK2-PR12-M00, LXK2-PR14-Q00, LXK2-PR14-R00 LXK2-PD12-Q00, LXK2-PD12-R00, LXK2-PD12-S00 LXK2-PH12-R00, LXK2-PH12-S00 LXK2-PL12-P00, LXK2-PL12-Q00, LXK2-PL12-R00 Source: www.luxeon.com KINGBRIGHT: KA-3528ASYC Source: www.kingbright.com
R1 R4-R15 = resistor:R-US_: RESISTOR, American symbol
U1 = texas:TUSB2077A: The Texas Instruments TUSB2007A in the 48-pin LQFP package. 7-port USB 2.0 hub/controller. Datasheet <http://www.ti.com/lit/ds/symlink/tusb2077a.pdf> Created by Ben Hurwitz, 10-6-16 Robotics@Maryland
U$1 = microchip:DCS6XXX: Microchip DSC6XXX Oscillator Various frequencies. NOTE: Some variations have different pinouts! Datasheet <http://ww1.microchip.com/downloads/en/DeviceDoc/20005625A.pdf>
U$2-U$9 = NXP:PRTR5V0U2X: NXP PRTR5V0U2X ESD Protection diode Ultra low capacitance, good for differential signals.
U$10 = hirose:HR30-6R-6PD: Hirose HR30-6R-6PD 6 pin round female connector, through-hole.
U$11 U$12 = avx:F93-XX-XXX-X-A: AVX Tantulum Capacitor Model number F93-XX-XXX-X-A Case A (1206)
U$13 = nonelectrical_mounting:MEMSENSE_NIMU
U$15 = molex:KK254_6PIN: Molex KK254 series 6-pin package Datasheet <http://www.molex.com/pdm_docs/sd/022032061_sd.pdf> Link <http://www.molex.com/molex/products/listview.jsp?query=&offset=0&filter=&fs=&npp=20&sType=a&autoNav=&path=+inmeta%3Apromotable%253Dyes+inmeta%3ACollectionName%253DImpulse++inmeta%3Acategory%253DPCB%252520Headers+inmeta%3Abreakaway%253DNo+inmeta%3Acircuitsloaded%253D6%2526partialfields%3D%28productname%3AKK%252520254%29&channel=products>